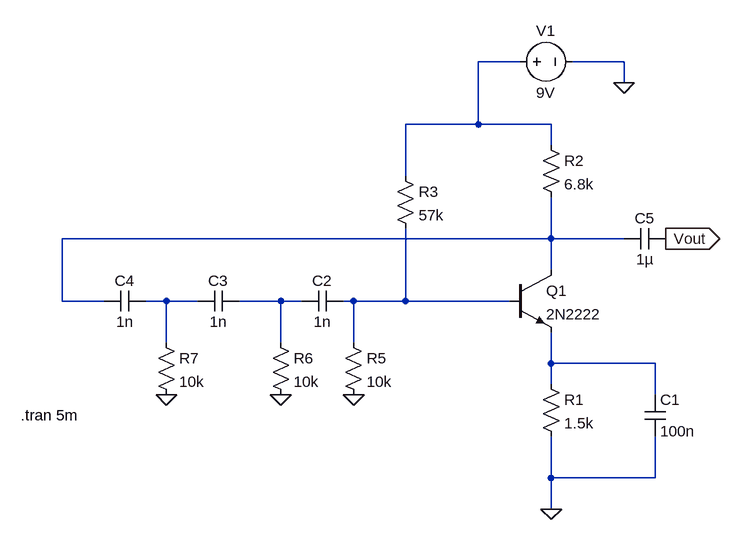
[diagram p0: schematic B20027_RC_PHASE.asc]
B20027_RC_PHASE.asc, the LTspice schematic file:
Version 4
SHEET 1 880 680
WIRE 160 -224 96 -224
WIRE 320 -224 240 -224
WIRE 320 -192 320 -224
WIRE 96 -128 96 -224
WIRE 96 -128 -16 -128
WIRE 208 -128 96 -128
WIRE 208 -96 208 -128
WIRE -16 -48 -16 -128
WIRE 208 48 208 -16
WIRE 208 48 -544 48
WIRE 320 48 208 48
WIRE 208 96 208 48
WIRE -544 144 -544 48
WIRE -480 144 -544 144
WIRE -384 144 -416 144
WIRE -336 144 -384 144
WIRE -208 144 -272 144
WIRE -176 144 -208 144
WIRE -96 144 -112 144
WIRE -16 144 -16 32
WIRE -16 144 -96 144
WIRE 144 144 -16 144
WIRE -384 208 -384 144
WIRE -208 208 -208 144
WIRE -96 208 -96 144
WIRE 208 240 208 192
WIRE 368 240 208 240
WIRE 208 272 208 240
WIRE 368 288 368 240
WIRE 208 416 208 352
WIRE 368 416 368 352
WIRE 368 416 208 416
WIRE 208 464 208 416
FLAG 320 -192 0
FLAG -384 288 0
FLAG -96 288 0
FLAG -208 288 0
FLAG 208 464 0
FLAG 384 48 Vout
IOPIN 384 48 Out
SYMBOL npn 144 96 R0
SYMATTR InstName Q1
SYMATTR Value 2N2222
SYMBOL res 192 256 R0
SYMATTR InstName R1
SYMATTR Value 1.5k
SYMBOL cap 352 288 R0
SYMATTR InstName C1
SYMATTR Value 100n
SYMBOL res -32 -64 R0
SYMATTR InstName R3
SYMATTR Value 57k
SYMBOL voltage 144 -224 R270
WINDOW 0 32 56 VTop 2
WINDOW 3 -32 56 VBottom 2
WINDOW 123 0 0 Left 0
WINDOW 39 0 0 Left 0
SYMATTR InstName V1
SYMATTR Value 9V
SYMBOL cap -112 128 R90
WINDOW 0 0 32 VBottom 2
WINDOW 3 32 32 VTop 2
SYMATTR InstName C2
SYMATTR Value 1n
SYMBOL cap -272 128 R90
WINDOW 0 0 32 VBottom 2
WINDOW 3 32 32 VTop 2
SYMATTR InstName C3
SYMATTR Value 1n
SYMBOL cap -416 128 R90
WINDOW 0 0 32 VBottom 2
WINDOW 3 32 32 VTop 2
SYMATTR InstName C4
SYMATTR Value 1n
SYMBOL res -112 192 R0
SYMATTR InstName R5
SYMATTR Value 10k
SYMBOL res -224 192 R0
SYMATTR InstName R6
SYMATTR Value 10k
SYMBOL res -400 192 R0
SYMATTR InstName R7
SYMATTR Value 10k
SYMBOL cap 384 32 R90
WINDOW 0 0 32 VBottom 2
WINDOW 3 32 32 VTop 2
SYMATTR InstName C5
SYMATTR Value 1µ
SYMBOL res 192 -112 R0
SYMATTR InstName R2
SYMATTR Value 6.8k
TEXT -608 320 Left 2 !.tran 5m

The netlist it stands for:
* B20027_RC_PHASE.asc
Q1 N002 N005 N006 0 2N2222
R1 N006 0 1.5k
C1 N006 0 100n
R3 N001 N005 57k
V1 N001 0 9V
C2 N005 N004 1n
C3 N004 N003 1n
C4 N003 N002 1n
R5 N005 0 10k
R6 N004 0 10k
R7 N003 0 10k
C5 Vout N002 1µ
R2 N001 N002 6.8k
.model NPN NPN
.model PNP PNP
.lib standard.bjt
.tran 5m
.backanno
.end